# Altium schematic sheet BlockDiagram.SchDoc
size B portrait; SheetNumber: 1; SheetTotal: 1
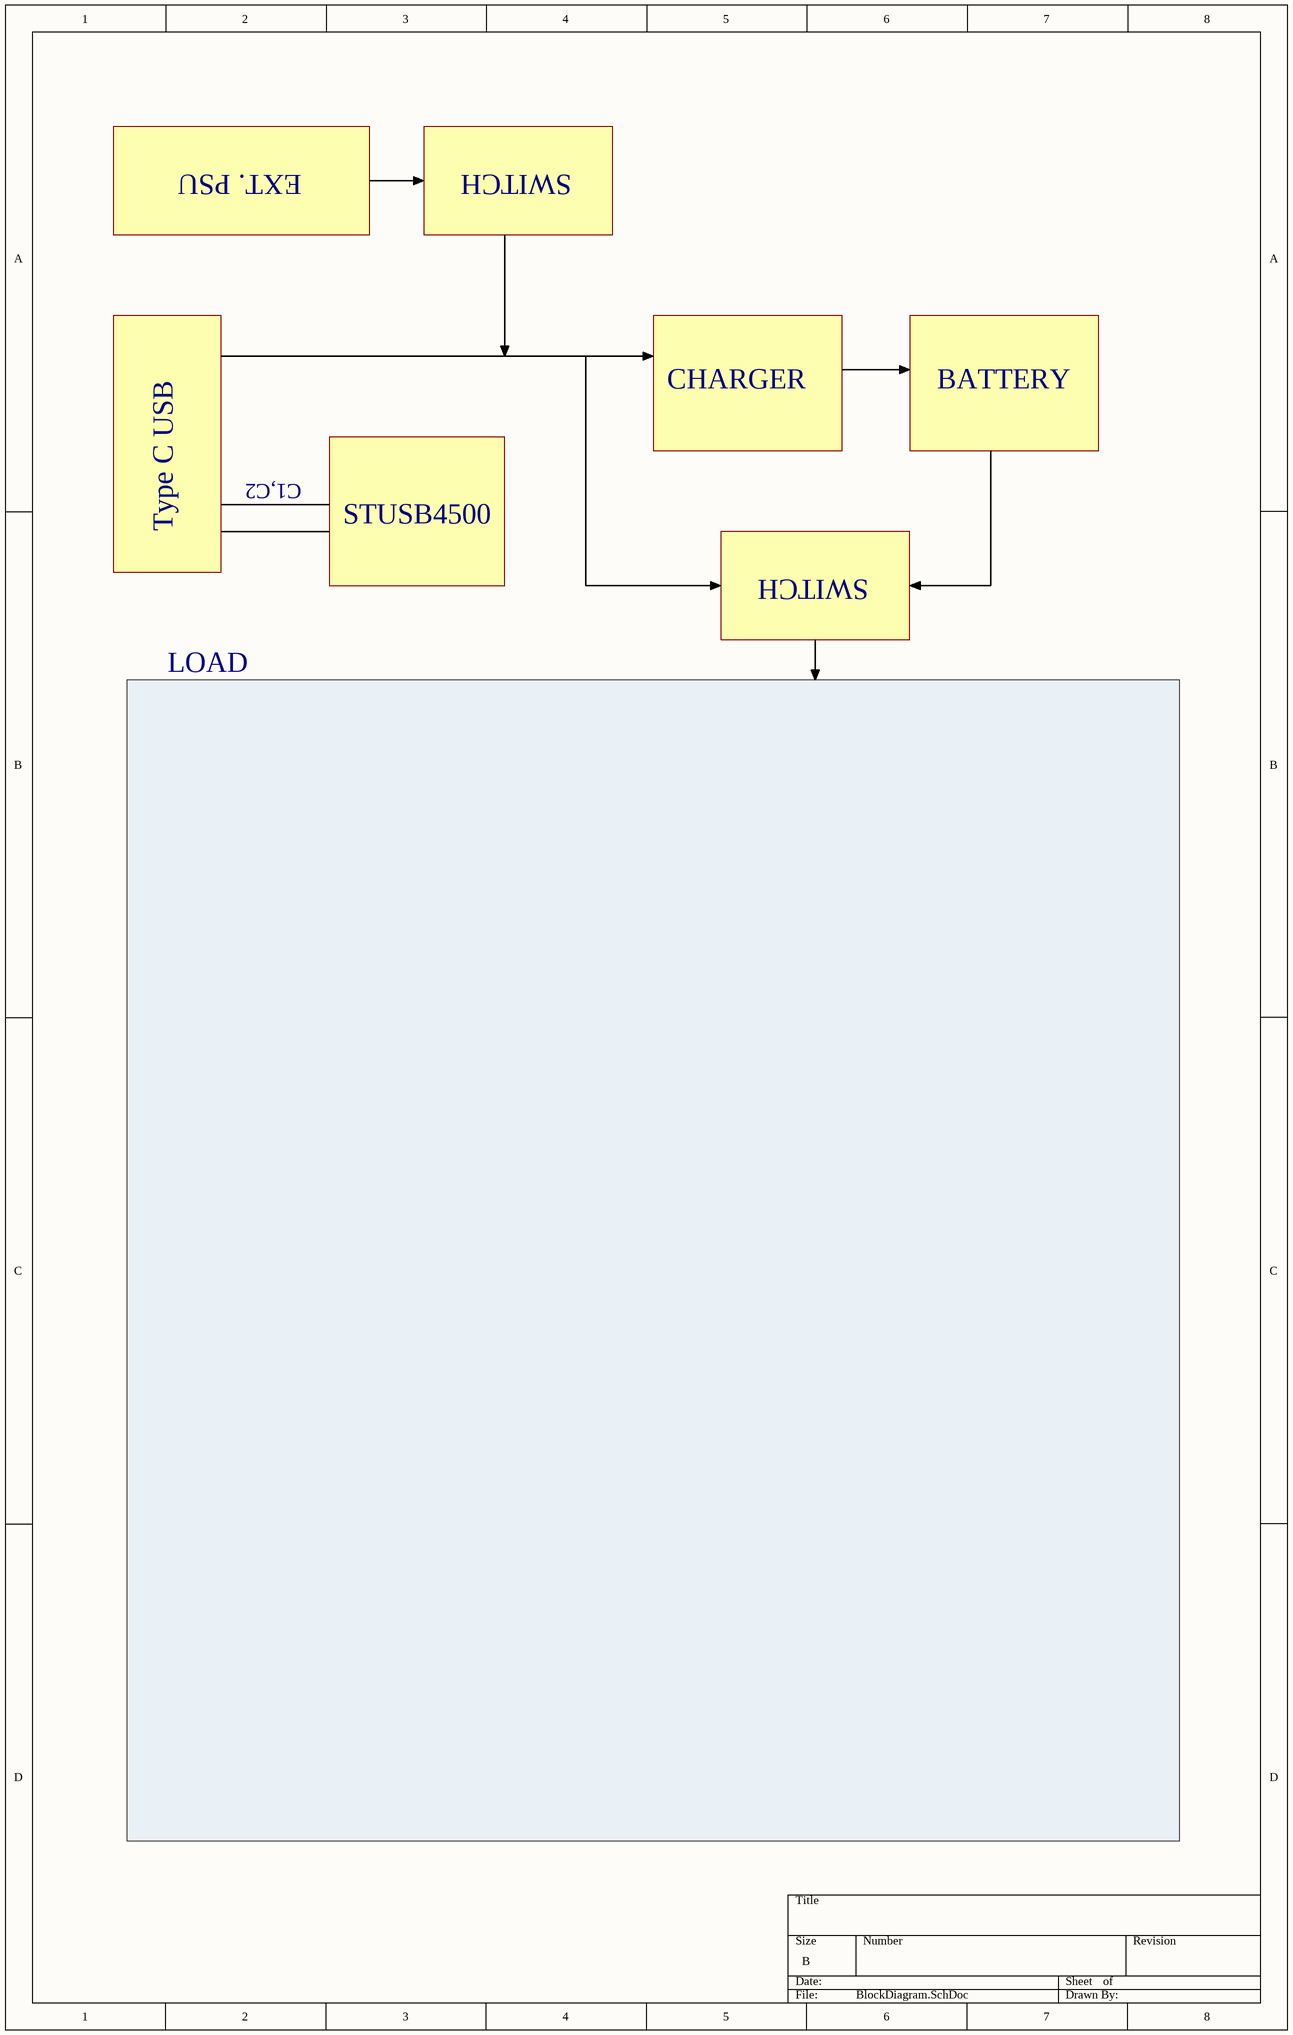
[diagram p0: BlockDiagram.SchDoc]

## Notes on the sheet
- EXT. PSU
- SWITCH
- CHARGER
- BATTERY
- C1,C2
- Type C USB
- STUSB4500
- LOAD